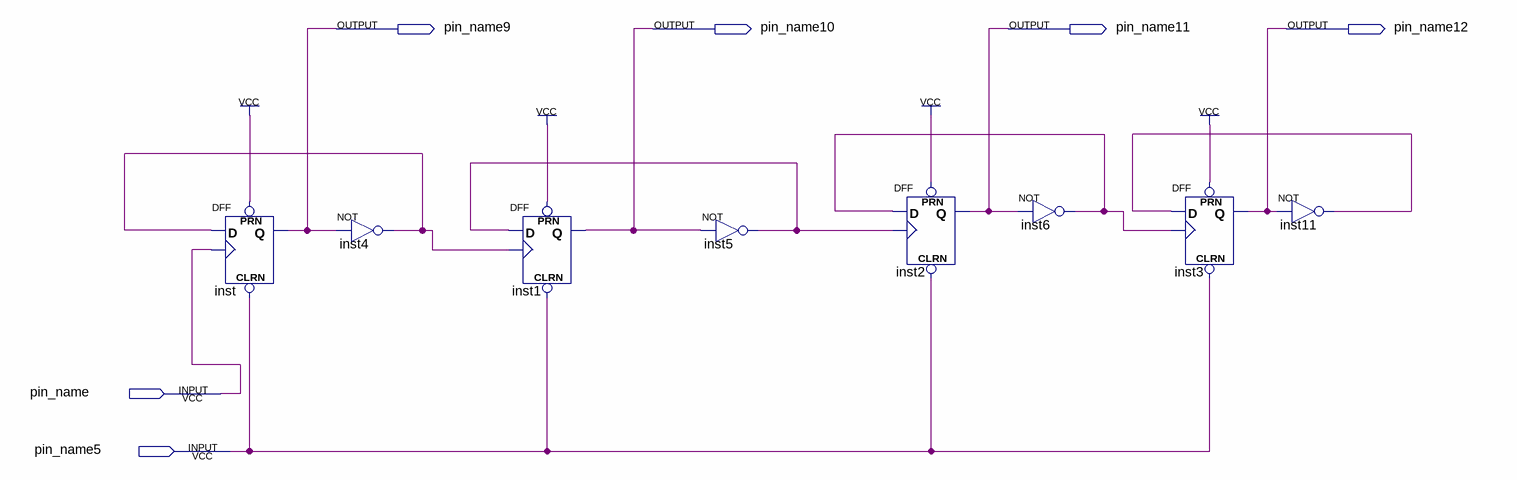
[diagram p0: schematic sheet]
// Quartus schematic test2.bdf as structural Verilog: 8 symbols, 6 pins
module test2 (
  input  pin_name,
  input  pin_name5,
  output pin_name9,
  output pin_name10,
  output pin_name11,
  output pin_name12
);

  wire inst4_out, inst5_out, inst6_out, inst11_out;

  DFF inst (.CLRN(pin_name5), .CLK(pin_name), .D(inst4_out), .PRN(1'b1), .Q(pin_name9));
  not inst4 (inst4_out, pin_name9);
  DFF inst1 (.CLRN(pin_name5), .CLK(inst4_out), .D(inst5_out), .PRN(1'b1), .Q(pin_name10));
  not inst5 (inst5_out, pin_name10);
  DFF inst2 (.CLRN(pin_name5), .CLK(inst5_out), .D(inst6_out), .PRN(1'b1), .Q(pin_name11));
  not inst6 (inst6_out, pin_name11);
  DFF inst3 (.CLRN(pin_name5), .CLK(inst6_out), .D(inst11_out), .PRN(1'b1), .Q(pin_name12));
  not inst11 (inst11_out, pin_name12);
endmodule
